# Altium schematic sheet Camera_Board.SchDoc: Camera Board
size A4; DrawnBy: byu17; Organization: ENEL429 Group 9; Address1: ECE Department; Address2: University of Canterbury; Address3: Christchurch 8041; Address4: New Zealand; Revision: 1; SheetNumber: 1; SheetTotal: 4
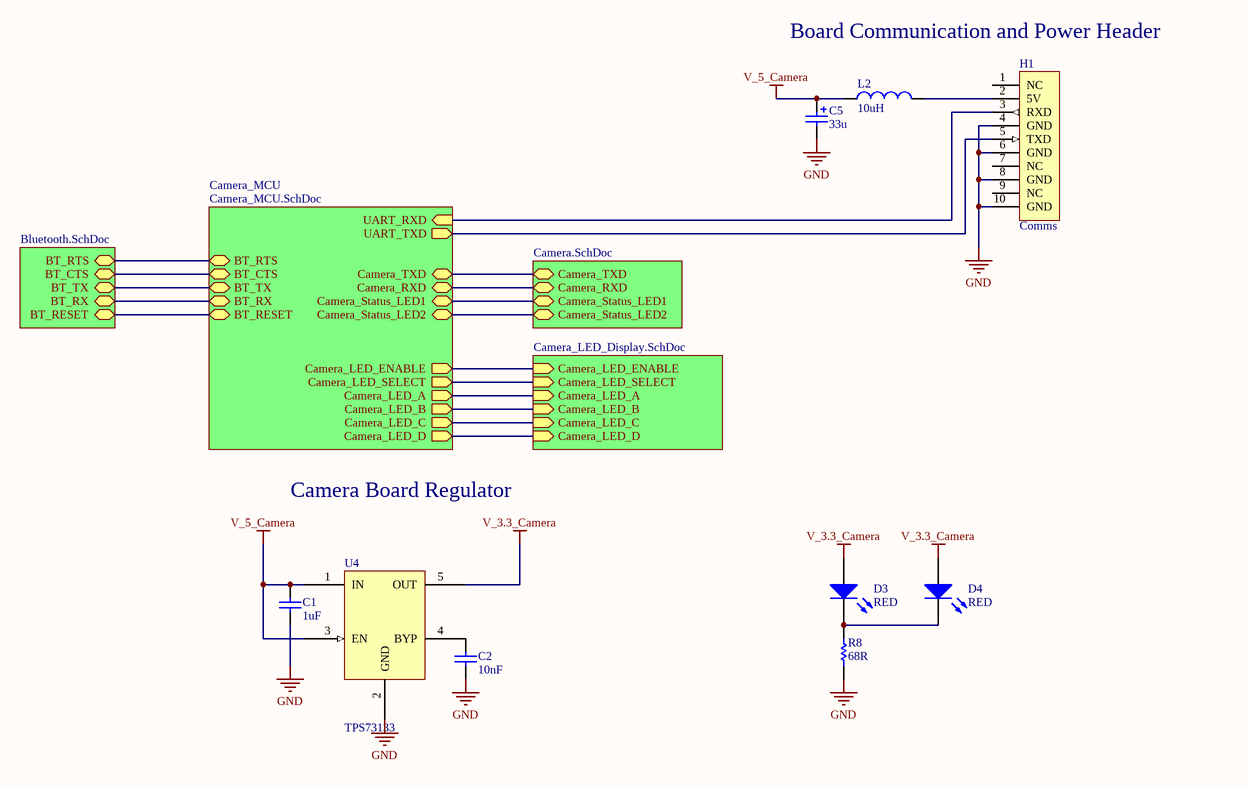
[diagram p0: Camera_Board.SchDoc]

## Parts
C1  1uF  [0603]
C2  10nF  [0603]
C5  value 33u  [6032]  (hidden comment: CP_TANT_33uF)
D3  value RED  [Diode_0805]  (hidden comment: LED Red)
D4  value RED  [Diode_0805]  (hidden comment: LED Red)
H1  Comms  [918510x323]
L2  10uH  [WE-PD]
R8  68R  [0603]
U4  TPS73133  [DBV005]

## Sub-sheets
Camera_MCU = Camera_MCU.SchDoc: BT_RTS, BT_CTS, BT_RESET, Camera_TXD, Camera_RXD, BT_TX, BT_RX, Camera_Status_LED1, Camera_Status_LED2, UART_TXD (out), UART_RXD (in), Camera_LED_B (out), Camera_LED_C (out), Camera_LED_ENABLE (out), Camera_LED_SELECT (out), Camera_LED_A (out), Camera_LED_D (out)
? = Bluetooth.SchDoc: BT_RX, BT_TX, BT_RTS, BT_CTS, BT_RESET
? = Camera.SchDoc: Camera_RXD, Camera_Status_LED1, Camera_Status_LED2, Camera_TXD
? = Camera_LED_Display.SchDoc: Camera_LED_ENABLE (in), Camera_LED_A (in), Camera_LED_B (in), Camera_LED_C (in), Camera_LED_D (in), Camera_LED_SELECT (in)

## Nets
GND: C1.1 C2.1 C5.2 H1.4(GND) H1.6(GND) H1.8(GND) H1.10(GND) R8.1 U4.2(GND)
V_3.3_Camera: D3.1(A) D4.1(A) U4.5(OUT)
V_5_Camera: C1.2 C5.1 L2.1 U4.1(IN) U4.3(EN)
NetC2_2: C2.2 U4.4(BYP)
NetD3_2: D3.2(K) D4.2(K) R8.2
NetH1_2: H1.2(5V) L2.2
NetH1_3: H1.3(RXD) ; sheet Camera_MCU/UART_RXD
NetH1_5: H1.5(TXD) ; sheet Camera_MCU/UART_TXD
(unnamed): sheet /BT_RX, sheet Camera_MCU/BT_RX
(unnamed): sheet /BT_TX, sheet Camera_MCU/BT_TX
(unnamed): sheet /BT_RTS, sheet Camera_MCU/BT_RTS
(unnamed): sheet /BT_CTS, sheet Camera_MCU/BT_CTS
(unnamed): sheet /BT_RESET, sheet Camera_MCU/BT_RESET
(unnamed): sheet /Camera_RXD, sheet Camera_MCU/Camera_RXD
(unnamed): sheet /Camera_Status_LED1, sheet Camera_MCU/Camera_Status_LED1
(unnamed): sheet /Camera_Status_LED2, sheet Camera_MCU/Camera_Status_LED2
(unnamed): sheet /Camera_TXD, sheet Camera_MCU/Camera_TXD
(unnamed): sheet Camera_MCU/Camera_LED_B, sheet /Camera_LED_B
(unnamed): sheet Camera_MCU/Camera_LED_C, sheet /Camera_LED_C
(unnamed): sheet Camera_MCU/Camera_LED_ENABLE, sheet /Camera_LED_ENABLE
(unnamed): sheet Camera_MCU/Camera_LED_SELECT, sheet /Camera_LED_SELECT
(unnamed): sheet Camera_MCU/Camera_LED_A, sheet /Camera_LED_A
(unnamed): sheet Camera_MCU/Camera_LED_D, sheet /Camera_LED_D

Not connected (* = marked no-connect by the designer): H1 1(NC) 7(NC) 9(NC)

## Notes on the sheet
- Board Communication and Power Header
- Camera Board Regulator
- Title
- Drawn by:
- Date:
- Time:
- Revision:
- Sheet
- of
- File:

## Library data of the parts
C1 = CP_1uF_50V_0603: CAP CER 1.0UF 50V X7R 0603; Manufacturer: Taiyo Yuden; Manufacturer PN: UMK107C5105KA-T; Supplier Part Number 1: 445-5090-2-ND; Supplier 1: Digi-Key; Value: 1uF; Part Number: CP_1uF_50V_0603; Component Kind: Standard; Component Type: Standard; Designator: CP_1uF_50V_0603; Pin Count: 2; Signal Integrity: Cap; Simulation: CAP
C2 = CP_10nF 0603: CAP CER 10000PF 100V X7R 0603; Manufacturer: Taiyo Yuden; Manufacturer PN: HMK107B7103KA-T; Supplier 1: Digi-Key; Supplier Part Number 1: 587-1446-2-ND; Value: 10nF; Part Number: CP_10nF 0603; Component Kind: Standard; Component Type: Standard; Designator: CP_10nF 0603; Pin Count: 2; Signal Integrity: Cap; Simulation: CAP
C5 = CP_TANT_33UF_20V: CAP TANT 33UF 20V 10% SMD; Manufacturer: Vishay; Manufacturer PN: TR3C336K020C0200; Signal Integrity: Cap Pol; Latest Revision Date: 20 Feb 09; Supplier 1: Digi-Key; Supplier Part Number 1: 718-1507-2-ND; Part Number: CP_TANT_33UF_20V; Component Kind: Standard; Component Type: Standard; Designator: CP_TANT_33UF_20V; Pin Count: 2; Simulation: CAP
D3 D4 = DL_LED Red 0805: Red LED 0805; Manufacturer PN: TLMS2100-GS08; Manufacturer: Vishay; Supplier 1: Digi-Key; Supplier Part Number 1: 350-2038-1-ND; Part Number: DL_LED Red 0805; Component Kind: Standard; Component Type: Standard; Designator: DL_LED Red 0805; Pin Count: 2; Simulation: LED0
H1 = Header 10: Header, IDC 10-Pin; LatestRevisionDate: 17-Jul-2002; LatestRevisionNote: Re-released for DXP Platform.; Publisher: Altium Limited
L2 = IN_10uH 2A SMT: INDUCTOR POWER 10UH 2.0A SMD; Manufacturer: Wurth Electronics Inc; Manufacturer PN: 744777910; LatestRevisionDate: 29 May 08; Supplier 1: Digi-Key; Supplier Part Number 1: 732-1191-1-ND; Value: 10uH; Part Number: IN_10uH 2A SMT; Component Kind: Standard; Component Type: Standard; Designator: IN_10uH 2A SMT; Pin Count: 2; Signal Integrity: Inductor; Simulation: INDUCTOR
R8 = RS_68R 0603: RES 68 OHM 1/10W 1% 0603 SMD; Manufacturer: Yageo; Manufacturer PN: RC0603FR-0768KL; LatestRevisionDate: 6 May 2011; Supplier 1: Digi-Key; Supplier Part Number 1: 311-68.0HRTR-ND; Value: 68R; Part Number: RS_68R 0603; Component Kind: Standard; Component Type: Standard; Designator: RS_68R 0603; Pin Count: 2; Signal Integrity: Res; Simulation: RESISTOR
U4 = IC_TPS73133: 150mA 3.3V linear regulator with 30mV dropout; Manufacturer: Texas Instruments; Supplier 1: Element 14; Supplier Part Number 1: 1207341; price: 0.84; Supplier 2: Digi-Key; Supplier Part Number 2: 296-15805-1-ND; value: TPS73133; Part Number: IC_TPS73133; Component Kind: Standard; Component Type: Standard; Designator: IC_TPS73133; Pin Count: 5